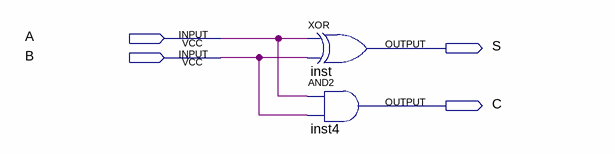
[diagram p0: schematic sheet]
// Quartus schematic halfadder.bdf as structural Verilog: 2 symbols, 4 pins
module halfadder (
  input  A,
  input  B,
  output S,
  output C
);

  xor inst (S, A, B);
  and inst4 (C, A, B);
endmodule
